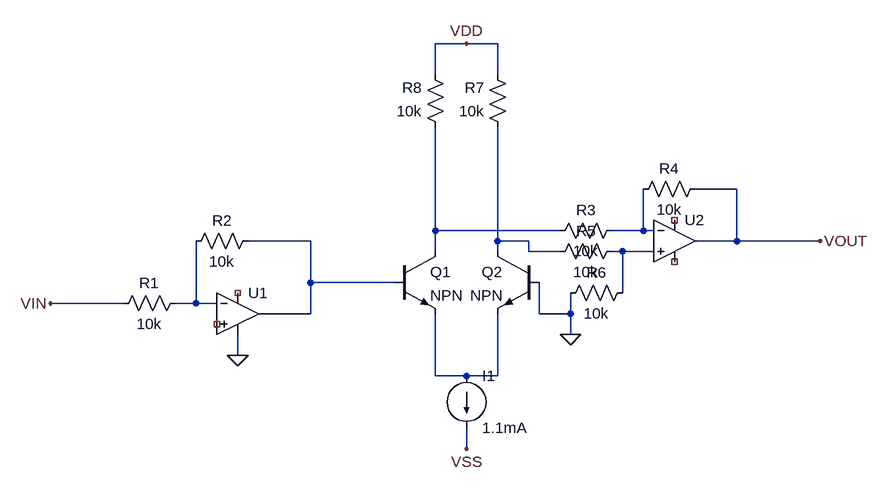
[diagram p0: schematic tanh_model.asc]
tanh_model.asc, the LTspice schematic file:
Version 4
SHEET 1 1024 680
WIRE 400 -240 352 -240
WIRE 448 -240 400 -240
WIRE 352 -192 352 -240
WIRE 448 -192 448 -240
WIRE 816 -16 752 -16
WIRE 352 48 352 -112
WIRE 544 48 352 48
WIRE 672 48 672 -16
WIRE 672 48 624 48
WIRE 688 48 672 48
WIRE 160 64 64 64
WIRE 448 64 448 -112
WIRE 496 64 448 64
WIRE 816 64 816 -16
WIRE 816 64 752 64
WIRE 944 64 816 64
WIRE 352 80 352 48
WIRE 448 80 448 64
WIRE 496 80 496 64
WIRE 544 80 496 80
WIRE 640 80 624 80
WIRE 688 80 640 80
WIRE 160 128 160 64
WIRE 288 128 160 128
WIRE 640 144 640 80
WIRE -128 160 -240 160
WIRE -16 160 -16 64
WIRE -16 160 -48 160
WIRE 16 160 -16 160
WIRE 160 176 160 128
WIRE 160 176 80 176
WIRE 512 176 512 128
WIRE 560 176 560 144
WIRE 560 176 512 176
WIRE 560 208 560 176
WIRE 48 240 48 208
WIRE 352 272 352 176
WIRE 400 272 352 272
WIRE 448 272 448 176
WIRE 448 272 400 272
WIRE 400 384 400 352
FLAG 48 240 0
FLAG 560 208 0
FLAG 944 64 VOUT
FLAG -240 160 VIN
FLAG 400 384 VSS
FLAG 400 -240 VDD
SYMBOL OpAmps\\UniversalOpAmp 48 176 R0
SYMATTR InstName U1
SYMBOL OpAmps\\UniversalOpAmp 720 64 R0
SYMATTR InstName U2
SYMBOL res -32 144 R90
WINDOW 0 0 56 VBottom 2
WINDOW 3 32 56 VTop 2
SYMATTR InstName R1
SYMATTR Value 10k
SYMBOL res 80 48 R90
WINDOW 0 0 56 VBottom 2
WINDOW 3 32 56 VTop 2
SYMATTR InstName R2
SYMATTR Value 10k
SYMBOL res 640 32 R90
WINDOW 0 0 56 VBottom 2
WINDOW 3 32 56 VTop 2
SYMATTR InstName R3
SYMATTR Value 10k
SYMBOL res 768 -32 R90
WINDOW 0 0 56 VBottom 2
WINDOW 3 32 56 VTop 2
SYMATTR InstName R4
SYMATTR Value 10k
SYMBOL res 640 64 R90
WINDOW 0 0 56 VBottom 2
WINDOW 3 32 56 VTop 2
SYMATTR InstName R5
SYMATTR Value 10k
SYMBOL res 656 128 R90
WINDOW 0 0 56 VBottom 2
WINDOW 3 32 56 VTop 2
SYMATTR InstName R6
SYMATTR Value 10k
SYMBOL res 464 -96 R180
WINDOW 0 36 76 Left 2
WINDOW 3 36 40 Left 2
SYMATTR InstName R7
SYMATTR Value 10k
SYMBOL res 368 -96 R180
WINDOW 0 36 76 Left 2
WINDOW 3 36 40 Left 2
SYMATTR InstName R8
SYMATTR Value 10k
SYMBOL npn 512 80 M0
SYMATTR InstName Q2
SYMBOL npn 288 80 R0
SYMATTR InstName Q1
SYMBOL current 400 272 R0
SYMATTR InstName I1
SYMATTR Value 1.1mA

The netlist it stands for:
* tanh_model.asc
XU1 NC_01 N006 NC_02 0 N003 level1 Avol=1Meg GBW=10Meg Vos=0 En=0 Enk=0 In=0 Ink=0 Rin=500Meg  ; pins In+ In- V+ V- OUT
XU2 N005 N002 NC_03 NC_04 VOUT level1 Avol=1Meg GBW=10Meg Vos=0 En=0 Enk=0 In=0 Ink=0 Rin=500Meg  ; pins In+ In- V+ V- OUT
R1 N006 VIN 10k
R2 N003 N006 10k
R3 N002 N001 10k
R4 VOUT N002 10k
R5 N005 N004 10k
R6 N005 0 10k
R7 N004 VDD 10k
R8 N001 VDD 10k
Q2 N004 0 N007 0 NPN
Q1 N001 N003 N007 0 NPN
I1 N007 VSS 1.1mA
.model NPN NPN
.model PNP PNP
.lib standard.bjt
.lib UniversalOpAmp1.lib
.backanno
.end